# Altium schematic sheet DIY_DAP_PCB_Power.SchDoc: DIY_DAP_PCB_Power
size A4; Revision: A; SheetNumber: 4; SheetTotal: 4
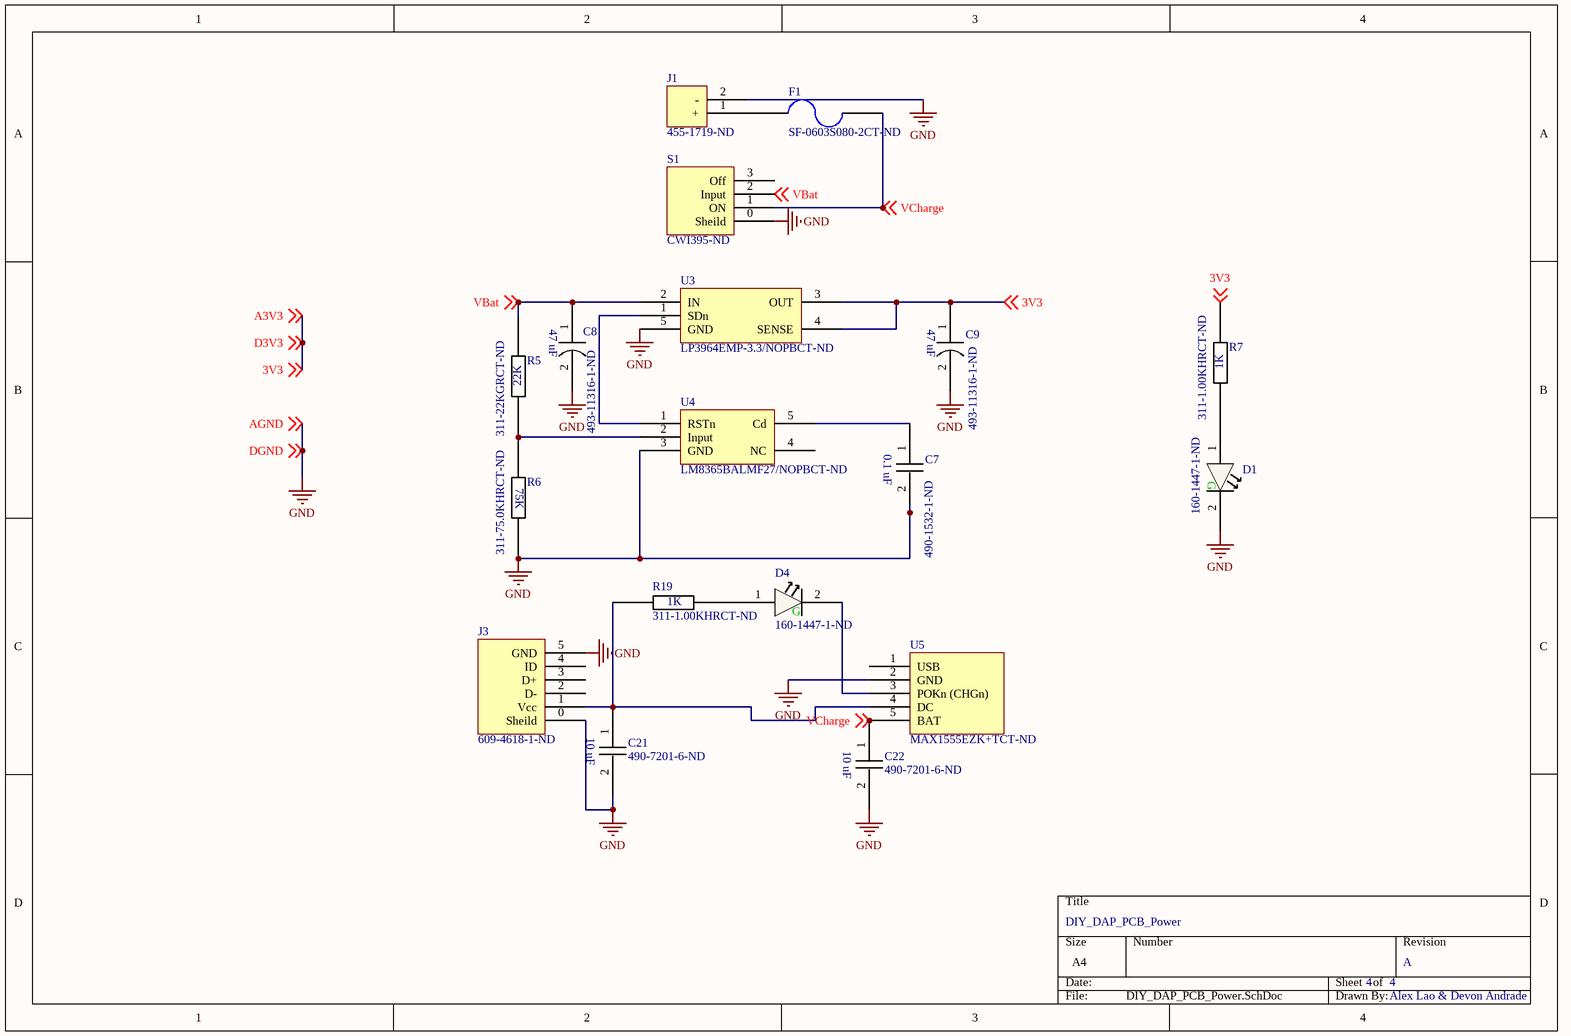
[diagram p0: DIY_DAP_PCB_Power.SchDoc]

## Parts
C7  490-1532-1-ND  [0603]
C8  493-11316-1-ND  [493-11316-1-ND]
C9  493-11316-1-ND  [493-11316-1-ND]
C21  490-7201-6-ND  [0603]
C22  490-7201-6-ND  [0603]
D1  160-1447-1-ND  [0603]
D4  160-1447-1-ND  [0603]
F1  SF-0603S080-2CT-ND  [0603]
J1  455-1719-ND  [455-1719-ND]
J3  609-4618-1-ND  [609-4618-1-ND]
R5  311-22KGRCT-ND  [0603]
R6  311-75.0KHRCT-ND  [0603]
R7  311-1.00KHRCT-ND  [0603]
R19  311-1.00KHRCT-ND  [0603]
S1  CWI395-ND  [CWI395-ND]
U3  LP3964EMP-3.3/NOPBCT-ND  [LP3964EMP-3.3/NOPBCT-ND]
U4  LM8365BALMF27/NOPBCT-ND  [LM8365BALMF27/NOPBCT-ND]
U5  MAX1555EZK+TCT-ND  [MAX1555EZK+TCT-ND]

## Nets
GND: C7.2 C8.2 C9.2 C21.2 C22.2 D1.2(-) J1.2(-) J3.0(Sheild) J3.5(GND) R6.2 S1.0(Sheild) U3.5(GND) U4.3(GND) U5.2(GND) ; off-sheet AGND, off-sheet DGND  [also labelled AGND, DGND]
3V3: C9.1 R7.2 U3.3(OUT) U3.4(SENSE) ; off-sheet 3V3, off-sheet A3V3, off-sheet D3V3  [also labelled A3V3, D3V3]
VBat: C8.1 R5.2 S1.2(Input) U3.2(IN) ; off-sheet VBat
VCharge: C22.1 F1.2 S1.1(ON) U5.5(BAT) ; off-sheet VCharge
NetC7_1: C7.1 U4.5(Cd)
NetC21_1: C21.1 J3.1(Vcc) R19.1 U5.4(DC)
NetD1_1: D1.1(+) R7.1
NetD4_1: D4.1(+) R19.2
NetD4_2: D4.2(-) U5.3(POKn_(CHGn))
NetF1_1: F1.1 J1.1(+)
NetR5_1: R5.1 R6.1 U4.2(Input)
NetU3_1: U3.1(SDn) U4.1(RSTn)

Not connected (* = marked no-connect by the designer): J3 2(D-) 3(D+) 4(ID); S1 3(Off); U4 4(NC); U5 1(USB)

## Notes on the sheet
- Alex Lao & Devon Andrade
- (in symbol 160-1447-1-ND) G
- (in symbol 311-1.00KHRCT-ND) 1K
- (in symbol 311-22KGRCT-ND) 22K
- (in symbol 311-75.0KHRCT-ND) 75K
- (in symbol 490-1532-1-ND) 0.1 uF
- (in symbol 490-7201-6-ND) 10 uF
- (in symbol 493-11316-1-ND) 47 uF

## Library data of the parts
C7 = 490-1532-1-ND: 0603 0.1 uF - 16V - Ceramic Capacitor; Supplier 1: Digi-Key
C8 C9 = 493-11316-1-ND: 47 uF - 10V - Electrolytic Capacitor; Supplier 1: Digi-Key
C21 C22 = 490-7201-6-ND: 0603 10 uF - 16V - Ceramic Capacitor; Supplier 1: Digi-Key
D1 D4 = 160-1447-1-ND: Green LED (0603); Supplier 1: Digi-Key
F1 = SF-0603S080-2CT-ND: 800 mA 32VDC Fuse; Supplier 1: Digi-Key
J1 = 455-1719-ND: JST-PH Battery Connector; Supplier 1: Digi-Key
J3 = 609-4618-1-ND: USB Micro-B; Supplier 1: Digi-Key
R5 = 311-22KGRCT-ND: 22k Ohm Resistor; Supplier 1: Digi-Key
R6 = 311-75.0KHRCT-ND: 75k Ohm Resistor; Supplier 1: Digi-Key
R7 R19 = 311-1.00KHRCT-ND: 1k Ohm Resistor; Supplier 1: Digi-Key
U3 = LP3964EMP-3.3/NOPBCT-ND: 3.3V LDO; Supplier 1: Digi-Key
U4 = LM8365BALMF27/NOPBCT-ND: Undervoltage Reset Controller; Supplier 1: Digi-Key
U5 = MAX1555EZK+TCT-ND: LiPo Charger; Supplier 1: Digi-Key
S1 = CWI395-ND: Supplier 1: Digi-Key